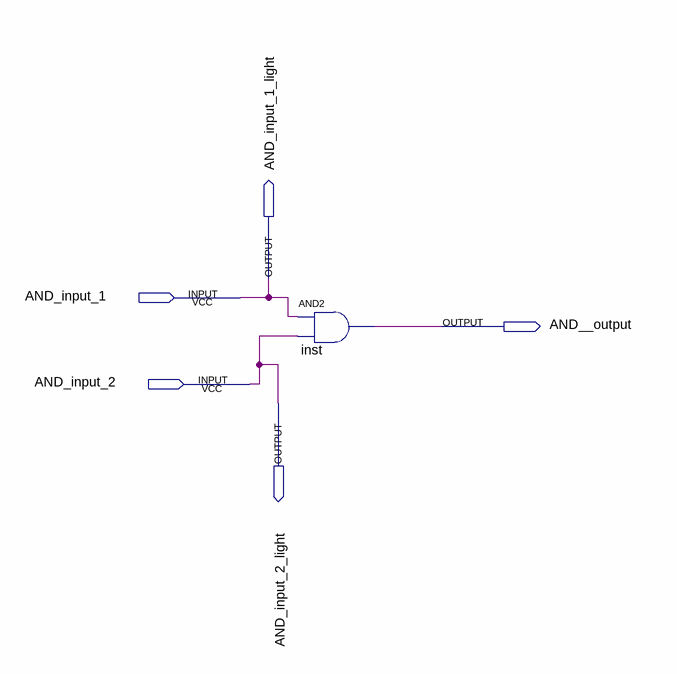
[diagram p0: schematic sheet]
// Quartus schematic Bruce_Liu_lab_1_block_diagram.bdf as structural Verilog: 1 symbols, 5 pins
module Bruce_Liu_lab_1_block_diagram (
  input  AND_input_1,
  input  AND_input_2,
  output AND_input_1_light,
  output AND__output,
  output AND_input_2_light
);

  and inst (AND__output, AND_input_1, AND_input_2);

  assign AND_input_1_light = AND_input_1;
  assign AND_input_2_light = AND_input_2;
endmodule
